# Altium schematic sheet 锐米LoRa终端评估DEMO板_硬件原理图.SchDoc
size A3
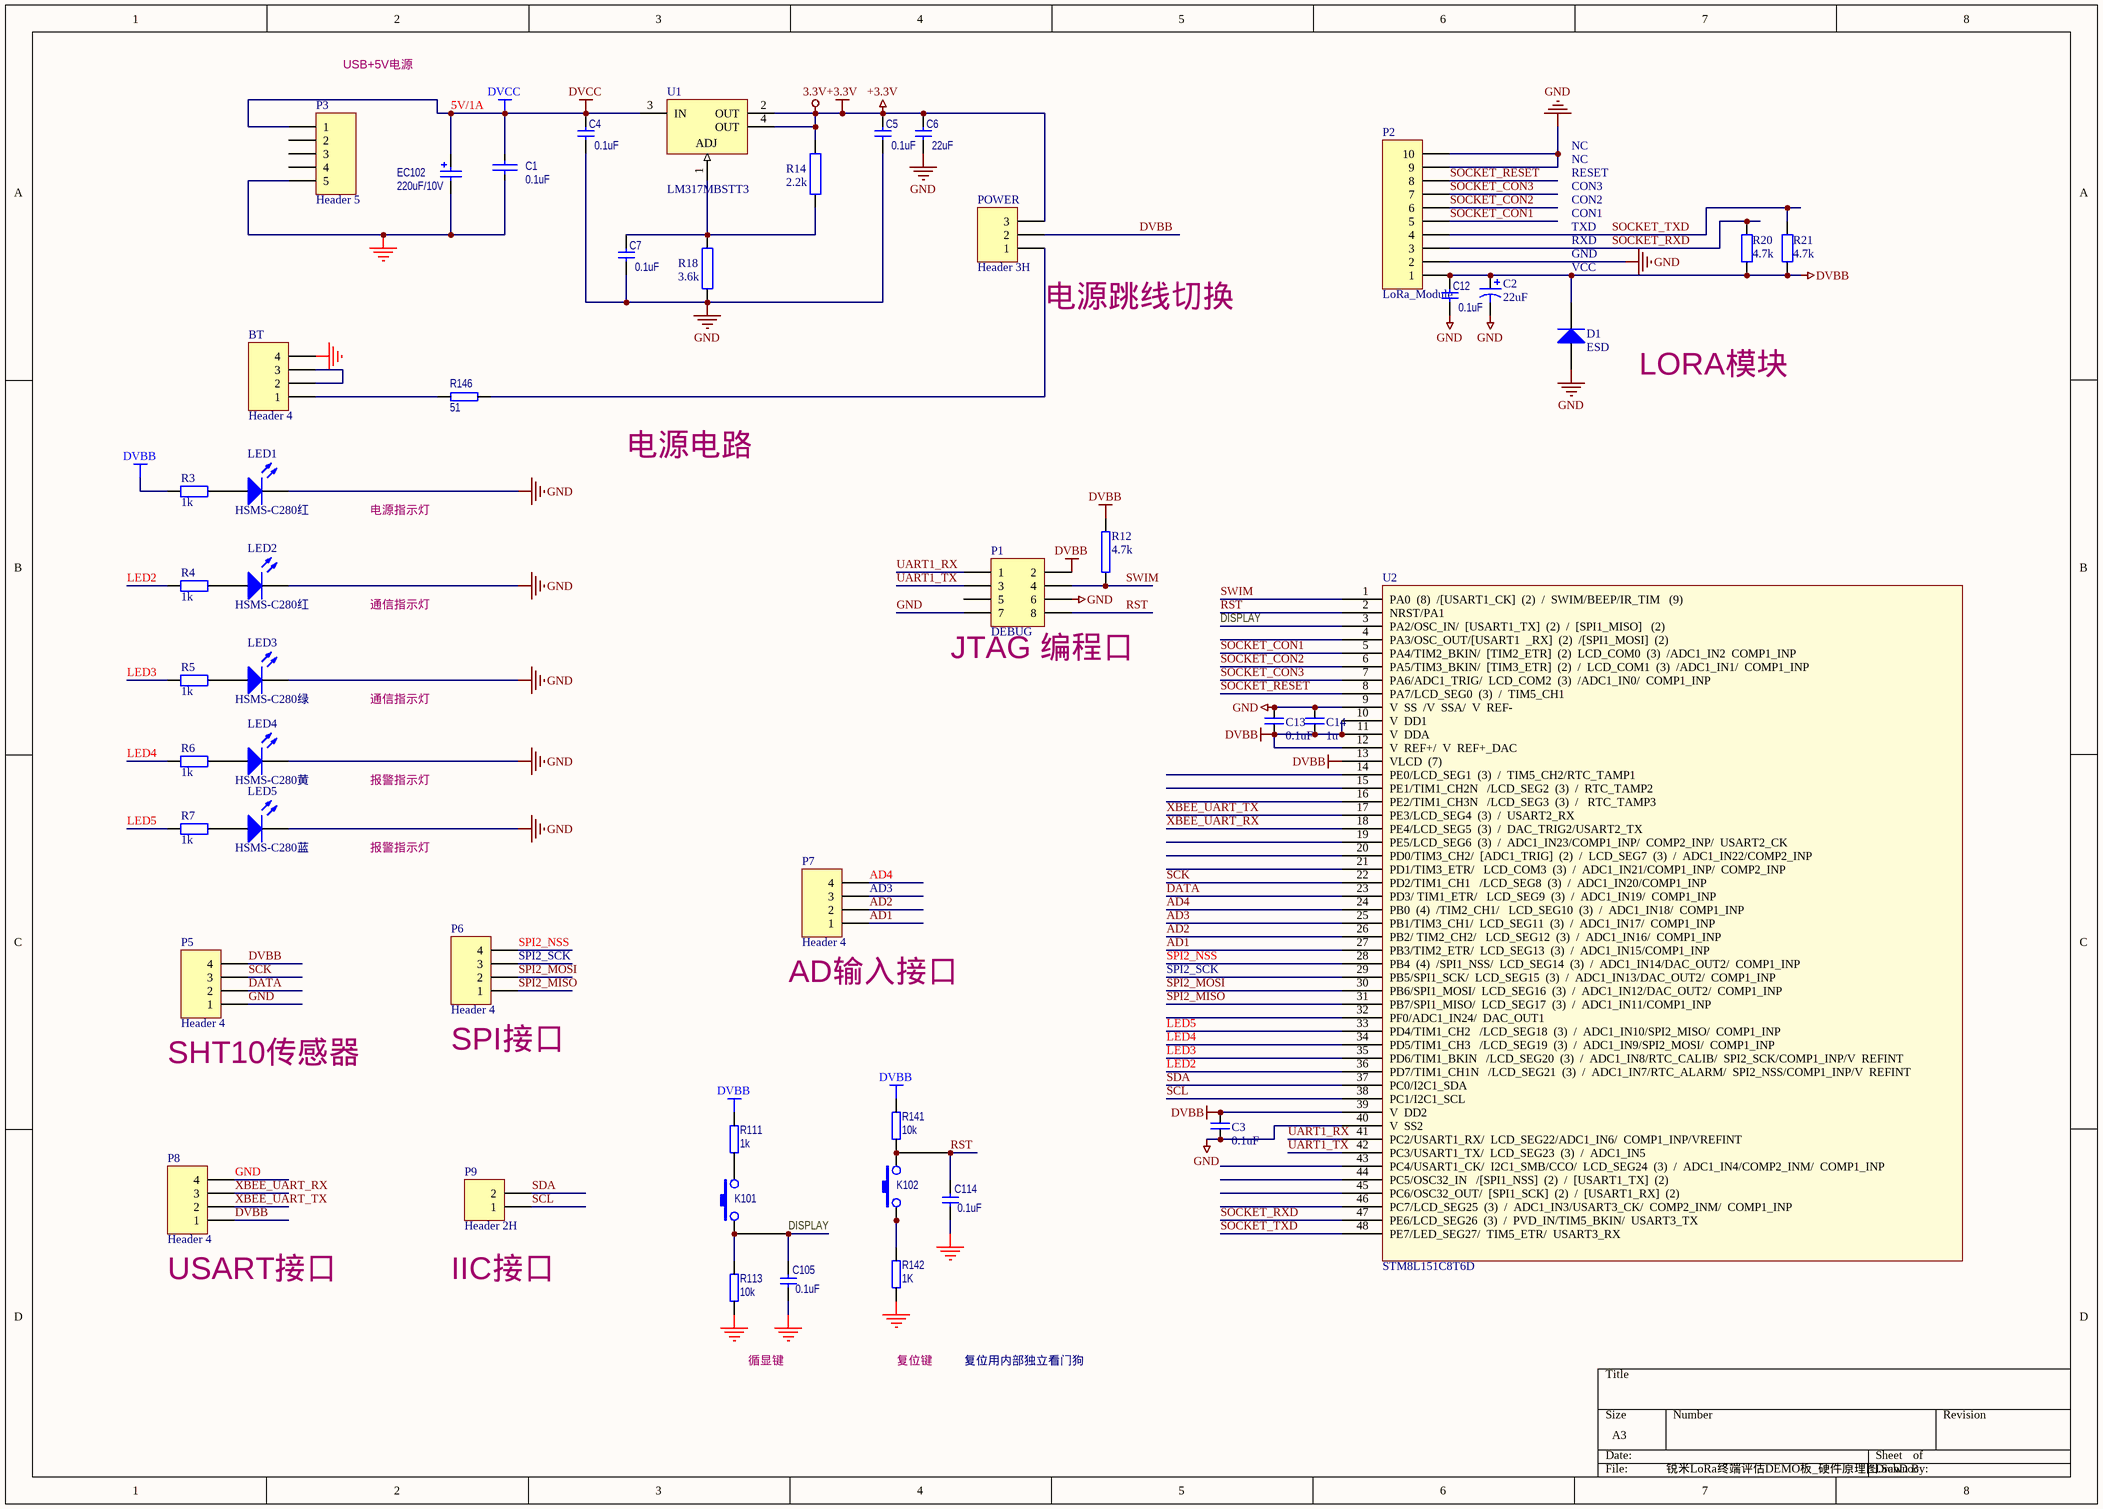
[diagram p0: 锐米LoRa终端评估DEMO板_硬件原理图.SchDoc]

## Parts
BT  Header 4  [BT-1]
C1  0.1uF  [0603C]
C2  value 22uF  [3225[1210]]  (hidden comment: Cap Pol1)
C3  0.1uF  [0603C]
C4  0.1uF  [0603c]
C5  0.1uF  [0603C]
C6  22uF  [3225[1210]]
C7  0.1uF  [0603C]
C12  0.1uF  [0603C]
C13  0.1uF  [0603C]
C14  1u  [0603C]
C105  0.1uF  [0603C]
C114  0.1uF  [0603C]
D1  ESD  [SOD123/X.85]
EC102  220uF/10V  [3225[1210]]
K101  (no value)  [KEYSMT]
K102  (no value)  [KEYSMT]
LED1  HSMS-C280红  [LED-SOP]
LED2  HSMS-C280红  [LED-SOP]
LED3  HSMS-C280绿  [LED-SOP]
LED4  HSMS-C280黄  [LED-SOP]
LED5  HSMS-C280蓝  [LED-SOP]
P1  DEBUG  [HDR-2X7-F-1.27MM_8]
P2  LoRa_Module  [LIRDA]
P3  Header 5  [USB-MINI]
P5  Header 4  [SHT10]
P6  Header 4  [HDR1X4]
P7  Header 4  [HDR1X4]
P8  Header 4  [HDR1X4]
P9  Header 2H  [SIP2]
POWER  Header 3H  [SIP3]
R3  value 1k  [0603R]  (hidden comment: Resistor)
R4  value 1k  [0603R]  (hidden comment: Resistor)
R5  value 1k  [0603R]  (hidden comment: Resistor)
R6  value 1k  [0603R]  (hidden comment: Resistor)
R7  value 1k  [0603R]  (hidden comment: Resistor)
R12  4.7k  [0603R]
R14  2.2k  [0603R]
R18  3.6k  [0603R]
R20  value 4.7k  [0603R]  (hidden comment: Resistor)
R21  value 4.7k  [0603R]  (hidden comment: Resistor)
R111  1k  [0603R]
R113  10k  [0603R]
R141  10k  [0603R]
R142  1K  [0603R]
R146  51  [0603R]
U1  LM317MBSTT3  [318E-04]
U2  STM8L151C8T6D  [LQFP48_L]

## Nets
+3.3V: C5.1 C6.1 POWER.3 R14.1 U1.2(OUT) U1.4(OUT)  [also labelled 3.3V]
DVBB: C2.1 C3.2 C12.1 C13.1 C14.1 D1.2(K) P1.2 P2.1 P5.4 P8.1 POWER.2 R3.1 R12.2 R20.1 R21.1 R111.1 R141.1 U2.10(V__DD1) U2.11(V__DDA) U2.12(V__REF+/__V__REF+_DAC) U2.13(VLCD__(7)) U2.39(V__DD2)
DVCC: C1.1 C4.1 EC102.1 P3.1 U1.3(IN)
GND: BT.4 C1.2 C2.2 C3.1 C4.2 C5.2 C6.2 C7.2 C12.2 C13.2 C14.2 C105.2 C114.2 D1.1(A) EC102.2 LED1.2(K) LED2.2(K) LED3.2(K) LED4.2(K) LED5.2(K) P1.6 P1.7 P2.2 P2.9 P2.10 P3.5 P5.1 P8.4 R18.2 R113.2 R142.1 U2.9(V__SS__/V__SSA/__V__REF-) U2.40(V__SS2)
AD1: P7.1 U2.27(PB3/TIM2_ETR/__LCD_SEG13__(3)__/__ADC1_IN15/COMP1_INP)
AD2: P7.2 U2.26(PB2/_TIM2_CH2/___LCD_SEG12__(3)__/__ADC1_IN16/__COMP1_INP)
AD3: P7.3 U2.25(PB1/TIM3_CH1/__LCD_SEG11__(3)__/__ADC1_IN17/__COMP1_INP)
AD4: P7.4 U2.24(PB0__(4)__/TIM2_CH1/___LCD_SEG10__(3)__/__ADC1_IN18/__COMP1_INP)
DATA: P5.2 U2.23(PD3/_TIM1_ETR/___LCD_SEG9__(3)__/__ADC1_IN19/__COMP1_INP)
DISPLAY: C105.1 K101.2 R113.1 U2.3(PA2/OSC_IN/__[USART1_TX]__(2)__/__[SPI1_MISO]___(2))
LED2: R4.1 U2.36(PD7/TIM1_CH1N___/LCD_SEG21__(3)__/__ADC1_IN7/RTC_ALARM/__SPI2_NSS/COMP1_INP/V__REFINT)
LED3: R5.1 U2.35(PD6/TIM1_BKIN___/LCD_SEG20__(3)__/__ADC1_IN8/RTC_CALIB/__SPI2_SCK/COMP1_INP/V__REFINT)
LED4: R6.1 U2.34(PD5/TIM1_CH3___/LCD_SEG19__(3)__/__ADC1_IN9/SPI2_MOSI/__COMP1_INP)
LED5: R7.1 U2.33(PD4/TIM1_CH2___/LCD_SEG18__(3)__/__ADC1_IN10/SPI2_MISO/__COMP1_INP)
RST: C114.1 K102.1 P1.8 R141.2 U2.2(NRST/PA1)
SCK: P5.3 U2.22(PD2/TIM1_CH1___/LCD_SEG8__(3)__/__ADC1_IN20/COMP1_INP)
SCL: P9.1 U2.38(PC1/I2C1_SCL)
SDA: P9.2 U2.37(PC0/I2C1_SDA)
SOCKET_CON1: P2.5 U2.5(PA4/TIM2_BKIN/__[TIM2_ETR]__(2)__LCD_COM0__(3)__/ADC1_IN2__COMP1_INP)
SOCKET_CON2: P2.6 U2.6(PA5/TIM3_BKIN/__[TIM3_ETR]__(2)__/__LCD_COM1__(3)__/ADC1_IN1/__COMP1_INP)
SOCKET_CON3: P2.7 U2.7(PA6/ADC1_TRIG/__LCD_COM2__(3)__/ADC1_IN0/__COMP1_INP)
SOCKET_RESET: P2.8 U2.8(PA7/LCD_SEG0__(3)__/__TIM5_CH1)
SOCKET_RXD: P2.3 R20.2 U2.47(PE6/LCD_SEG26__(3)__/__PVD_IN/TIM5_BKIN/__USART3_TX)
SOCKET_TXD: P2.4 R21.2 U2.48(PE7/LED_SEG27/__TIM5_ETR/__USART3_RX)
SPI2_MISO: P6.1 U2.31(PB7/SPI1_MISO/__LCD_SEG17__(3)__/__ADC1_IN11/COMP1_INP)
SPI2_MOSI: P6.2 U2.30(PB6/SPI1_MOSI/__LCD_SEG16__(3)__/__ADC1_IN12/DAC_OUT2/__COMP1_INP)
SPI2_NSS: P6.4 U2.28(PB4__(4)__/SPI1_NSS/__LCD_SEG14__(3)__/__ADC1_IN14/DAC_OUT2/__COMP1_INP)
SPI2_SCK: P6.3 U2.29(PB5/SPI1_SCK/__LCD_SEG15__(3)__/__ADC1_IN13/DAC_OUT2/__COMP1_INP)
SWIM: P1.4 R12.1 U2.1(PA0__(8)__/[USART1_CK]__(2)__/__SWIM/BEEP/IR_TIM___(9))
UART1_RX: P1.1 U2.41(PC2/USART1_RX/__LCD_SEG22/ADC1_IN6/__COMP1_INP/VREFINT)
UART1_TX: P1.3 U2.42(PC3/USART1_TX/__LCD_SEG23__(3)__/__ADC1_IN5)
XBEE_UART_RX: P8.3 U2.18(PE4/LCD_SEG5__(3)__/__DAC_TRIG2/USART2_TX)
XBEE_UART_TX: P8.2 U2.17(PE3/LCD_SEG4__(3)__/__USART2_RX)
NetBT_1: BT.1 R146.2
NetBT_2: BT.2 BT.3
NetC7_1: C7.1 R14.2 R18.1 U1.1(ADJ)
NetK101_1: K101.1 R111.2
NetK102_2: K102.2 R142.2
NetLED1_1: LED1.1(A) R3.2
NetLED2_1: LED2.1(A) R4.2
NetLED3_1: LED3.1(A) R5.2
NetLED4_1: LED4.1(A) R6.2
NetLED5_1: LED5.1(A) R7.2
NetPOWER_1: POWER.1 R146.1

Not connected (* = marked no-connect by the designer): P1 5; P3 2 3 4; U2 4(PA3/OSC_OUT/[USART1___RX]__(2)__/[SPI1_MOSI]__(2)) 14(PE0/LCD_SEG1__(3)__/__TIM5_CH2/RTC_TAMP1) 15(PE1/TIM1_CH2N___/LCD_SEG2__(3)__/__RTC_TAMP2) 16(PE2/TIM1_CH3N___/LCD_SEG3__(3)__/___RTC_TAMP3) 19(PE5/LCD_SEG6__(3)__/__ADC1_IN23/COMP1_INP/__COMP2_INP/__USART2_CK) 20(PD0/TIM3_CH2/__[ADC1_TRIG]__(2)__/__LCD_SEG7__(3)__/__ADC1_IN22/COMP2_INP) 21(PD1/TIM3_ETR/___LCD_COM3__(3)__/__ADC1_IN21/COMP1_INP/__COMP2_INP) 32(PF0/ADC1_IN24/__DAC_OUT1) 43(PC4/USART1_CK/__I2C1_SMB/CCO/__LCD_SEG24__(3)__/__ADC1_IN4/COMP2_INM/__COMP1_INP) 44(PC5/OSC32_IN___/[SPI1_NSS]__(2)__/__[USART1_TX]__(2)) 45(PC6/OSC32_OUT/__[SPI1_SCK]__(2)__/__[USART1_RX]__(2)) 46(PC7/LCD_SEG25__(3)__/__ADC1_IN3/USART3_CK/__COMP2_INM/__COMP1_INP)

## Notes on the sheet
- USB+5V电源
- 5V/1A
- RESET
- NC
- CON3
- CON2
- CON1
- TXD
- RXD
- (near POWER) 电源跳线切换
- GND
- VCC
- LORA模块
- 电源指示灯
- 电源电路
- 通信指示灯
- (near P1) JTAG 编程口
- 报警指示灯
- (near P7) AD输入接口
- (near P6) SPI接口
- (near P5) SHT10传感器
- (near P8) USART接口
- (near P9) IIC接口
- 循显键
- 复位键
- 复位用内部独立看门狗

## Library data of the parts
BT P5-P8 = Header 4: Header, 4-Pin; LatestRevisionDate: 17-Jul-2002; LatestRevisionNote: Re-released for DXP Platform.; Publisher: Altium Limited
C1 = CAP: Capacitor
C2 EC102 = Cap Pol1: Polarized Capacitor (Radial)
  C2: Published: 8-Jun-2000; LatestRevisionDate: 17-Jul-2002; LatestRevisionNote: Re-released for DXP Platform.; PackageReference: RB7.6-15; Publisher: Altium Limited
  EC102: Published: *; Publisher: *; Manufacturer: *; Class: *; SubClass: *
C3 C13 C14 = 0603_50V_15pF±5% NPO: 电容__贴片; 规格: *; 货号: *; 名称: *; 含税单价: *; 厂商: *; 备注: *
C4-C7 C12 C105 C114 = ProE.tmp_22p_13
D1 = Diode: Default Diode; Published: 8-Jun-2000; LatestRevisionDate: 17-Jul-2002; LatestRevisionNote: Re-released for DXP Platform.; PackageVersion: Sep-1996; PackageReference: SMC; Publisher: Altium Limited; Code_JEDEC: DO-214-AB
K101 K102 = SW-PB
LED1-LED5 = HSMS-C280: Miniature Chip LED, Red; LuminousIntensity: 2.5mcd (Minimum).; PCB_Layout: Complies with manufacturer's recommendation.; Published: 11-Dec-2002; DatasheetDocument: 7-Mar-2002; PackageDocument: 07-Mar-2002; PackageReference: 1.0X0.5X0.4; Publisher: Altium Limited; LED_Colour: Red; ComponentLink1Description: Manufacturer Link; ComponentLink1URL: http://www.agilent.com/; ComponentLink2Description: Datasheet; ComponentLink2URL: http://cp.literature.agilent.com/litweb/pdf/5988-5890EN.pdf
P1 = Header 4X2: Header, 4-Pin, Dual row; LatestRevisionDate: 17-Jul-2002; LatestRevisionNote: Re-released for DXP Platform.; Publisher: Altium Limited
P2 = Header 10: Header, 10-Pin; LatestRevisionDate: 17-Jul-2002; LatestRevisionNote: Re-released for DXP Platform.; Publisher: Altium Limited
P3 = Header 5: Header, 5-Pin; LatestRevisionDate: 17-Jul-2002; LatestRevisionNote: Re-released for DXP Platform.; Publisher: Altium Limited
P9 = Header 2H: Header, 2-Pin, Right Angle; LatestRevisionDate: 17-Jul-2002; LatestRevisionNote: Re-released for DXP Platform.; Publisher: Altium Limited
POWER = Header 3H: Header, 3-Pin, Right Angle; LatestRevisionDate: 17-Jul-2002; LatestRevisionNote: Re-released for DXP Platform.; Publisher: Altium Limited
R3-R7 R20 R21 = Resistor: Resistor SMD - IEC symbol version; LatestRevisionDate: 27-Jul-20  -  Semtech
R12 = RES2: 筿��
R14 R18 = 0603_20kΩ±1%100ppm/℃: 电阻_贴片; 规格: RC-0603-1/10W-20kΩ±1% 100ppm/℃-YAGEO; 货号: R20321S0; 名称: 贴片电阻; 厂商: YAGEO
R111 R113 R141 R142 R146 = ProE.tmp_10k_66
U1 = LM317MBSTT3: Three-Terminal Adjustable Output Positive Voltage Regulator; Note: Pin 2 is electrically connected to Pin 4 (TAB); Published: 15-Apr-2002; DatasheetVersion: Nov-1999; PackageVersion: Nov-1999; PackageReference: 318E-04; Publisher: Altium Limited; PackageDescription: SOT-223/SC-73; 4 Leads; Body 6.7 x 7.3 mm, inc. leads (LxW max); ComponentLink1Description: Manufacturer Link; ComponentLink1URL: http://www.onsemi.com/site/products/taxonomy/0,4438,503,00.html; ComponentLink2Description: Datasheet; ComponentLink2URL: http://www.onsemi.com/pub/Collateral/LM317M-D.PDF
U2 = Component_1